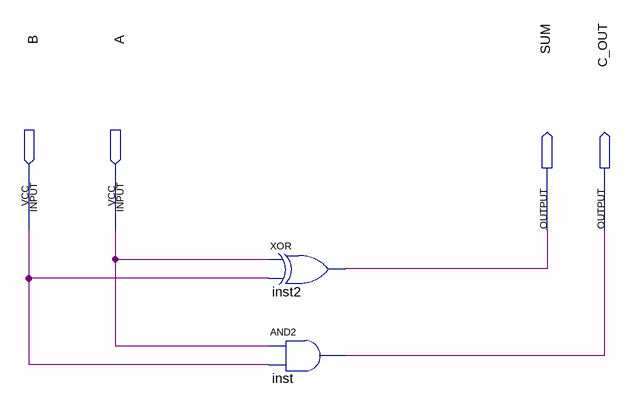
[diagram p0: schematic sheet]
// Quartus schematic Half_Adder.bdf as structural Verilog: 2 symbols, 4 pins
module Half_Adder (
  input  B,
  input  A,
  output SUM,
  output C_OUT
);

  xor inst2 (SUM, A, B);
  and inst (C_OUT, A, B);
endmodule
